# Altium schematic sheet 0_project_description.SchDoc
size A
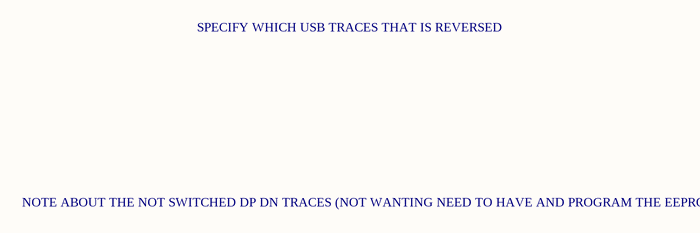
[diagram p0: 0_project_description.SchDoc]

## Notes on the sheet
- SPECIFY WHICH USB TRACES THAT IS REVERSED
- NOTE ABOUT THE NOT SWITCHED DP DN TRACES (NOT WANTING NEED TO HAVE AND PROGRAM THE EEPROM)